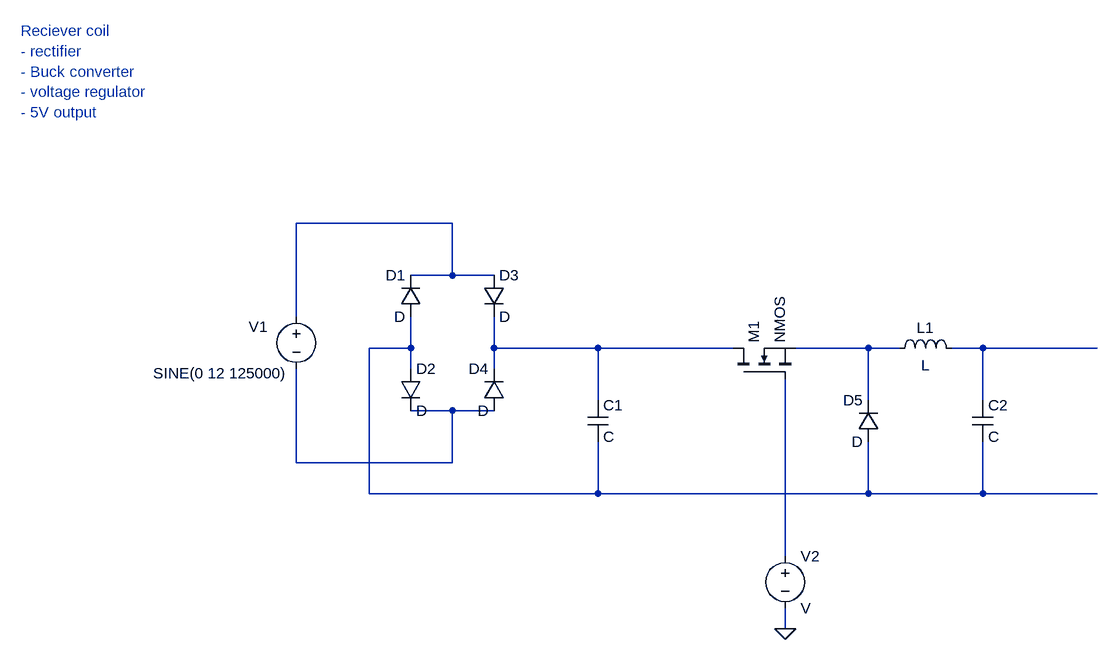
[diagram p0: schematic Reciever.asc]
Reciever.asc, the LTspice schematic file:
Version 4.1
SHEET 1 1176 836
WIRE 128 192 -112 192
WIRE 128 272 128 192
WIRE 128 272 64 272
WIRE 192 272 128 272
WIRE -112 336 -112 192
WIRE 64 384 64 336
WIRE 64 384 0 384
WIRE 192 384 192 336
WIRE 352 384 192 384
WIRE 560 384 352 384
WIRE 768 384 656 384
WIRE 816 384 768 384
WIRE 944 384 896 384
WIRE 1120 384 944 384
WIRE 64 416 64 384
WIRE 192 416 192 384
WIRE 352 464 352 384
WIRE 768 464 768 384
WIRE 944 464 944 384
WIRE 128 480 64 480
WIRE 192 480 128 480
WIRE -112 560 -112 416
WIRE 128 560 128 480
WIRE 128 560 -112 560
WIRE 0 608 0 384
WIRE 352 608 352 528
WIRE 352 608 0 608
WIRE 768 608 768 528
WIRE 768 608 352 608
WIRE 944 608 944 528
WIRE 944 608 768 608
WIRE 1120 608 944 608
WIRE 640 704 640 432
WIRE 640 816 640 784
FLAG 640 816 0
SYMBOL voltage -112 320 R0
WINDOW 0 -73 31 Left 2
WINDOW 3 -220 103 Left 2
WINDOW 123 0 0 Left 0
WINDOW 39 0 0 Left 0
SYMATTR InstName V1
SYMATTR Value SINE(0 12 125000)
SYMBOL diode 80 336 R180
WINDOW 0 24 64 Left 2
WINDOW 3 24 0 Left 2
SYMATTR InstName D1
SYMBOL diode 48 416 R0
SYMATTR InstName D2
SYMBOL diode 176 272 R0
SYMATTR InstName D3
SYMBOL diode 208 480 R180
WINDOW 0 24 64 Left 2
WINDOW 3 24 0 Left 2
SYMATTR InstName D4
SYMBOL cap 336 464 R0
SYMATTR InstName C1
SYMBOL nmos 560 432 R270
SYMATTR InstName M1
SYMBOL diode 784 528 R180
WINDOW 0 24 64 Left 2
WINDOW 3 24 0 Left 2
SYMATTR InstName D5
SYMBOL ind 800 400 R270
WINDOW 0 32 56 VTop 2
WINDOW 3 5 56 VBottom 2
SYMATTR InstName L1
SYMBOL cap 928 464 R0
SYMATTR InstName C2
SYMBOL voltage 640 688 R0
SYMATTR InstName V2
TEXT -536 -104 Left 2 ;Reciever coil\n- rectifier\n- Buck converter\n- voltage regulator\n- 5V output

The netlist it stands for:
* Reciever.asc
V1 N001 N006 SINE(0 12 125000)
D1 N002 N001 D
D2 N002 N006 D
D3 N001 N003 D
D4 N006 N003 D
C1 N003 N002 C
M1 N003 N007 N004 N004 NMOS
D5 N002 N004 D
L1 N004 N005 L
C2 N005 N002 C
V2 N007 0 V
.model D D
.lib standard.dio
.model NMOS NMOS
.model PMOS PMOS
.lib standard.mos
* Reciever coil
* - rectifier
* - Buck converter
* - voltage regulator
* - 5V output
.backanno
.end